# Altium schematic sheet 780-00029,rev1,Pg1,Backplane, Instrument Crate.SchDoc
size B; PageSetup: Record=PageOptions|CenterHorizontal=True|CenterVertical=True|PrintScale=1.09|XCorrection=1.00|YCorrection=1.00|PrintKind=0|BorderSize=5000000|LeftOffset=0|BottomOffset=0|Orientation=2|PaperLength=1000|PaperWidth=1000|Scale=100|PaperSource=7|PrintQuality=-4|MediaType=1|DitherType=10|PaperKind=Tabloid 11 x 17in|PrintScaleMode=1
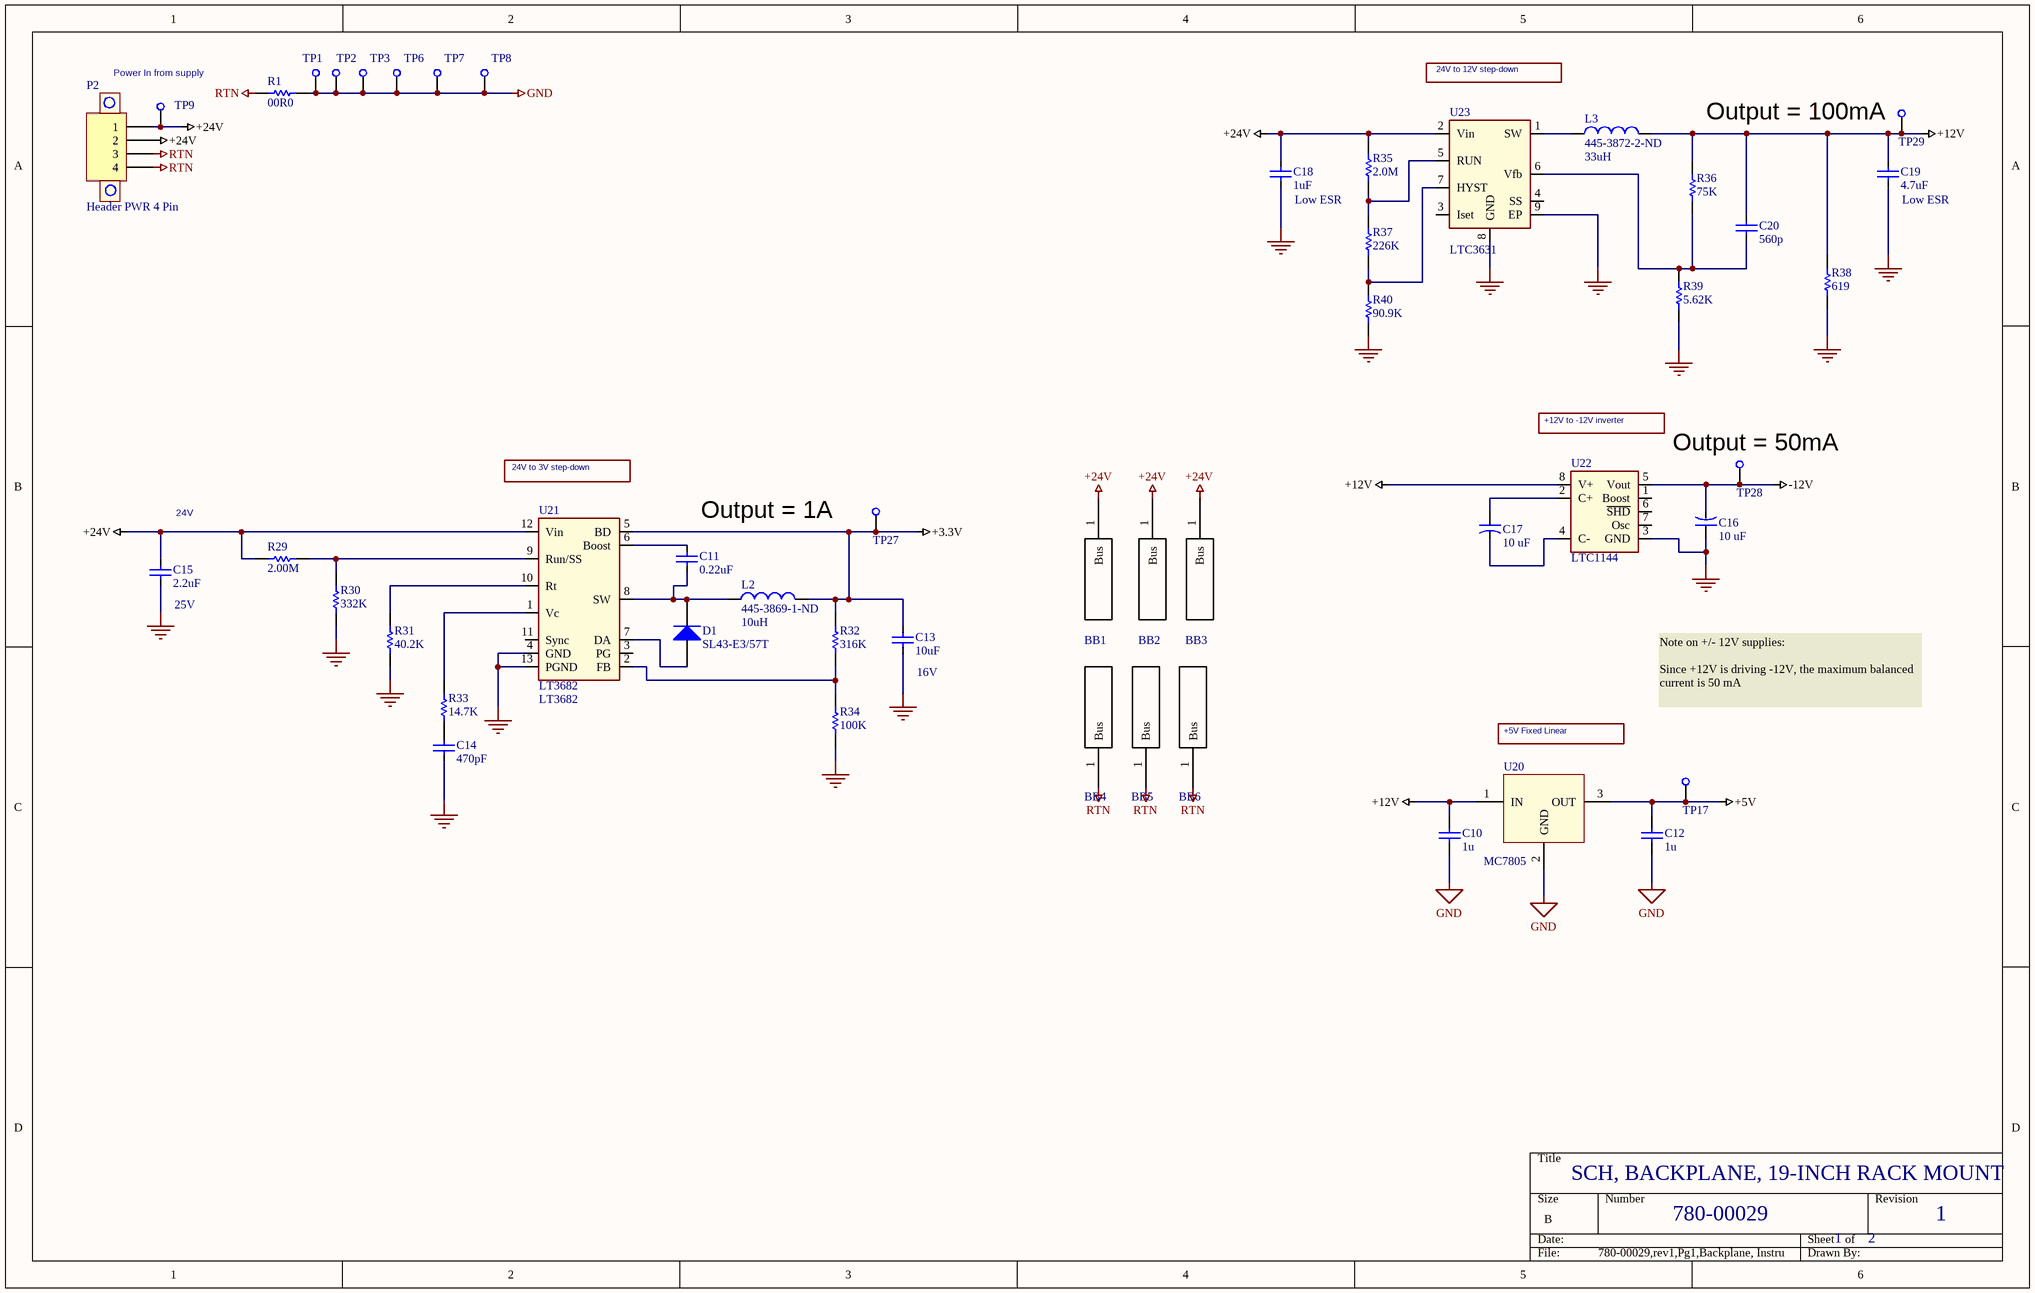
[diagram p0: 780-00029,rev1,Pg1,Backplane, Instrument Crate.SchDoc]

## Parts
BB1  Bus Bar  [Bus Bar 1.5" pitch]  (value not drawn)
BB2  Bus Bar  [Bus Bar 1.5" pitch]  (value not drawn)
BB3  Bus Bar  [Bus Bar 1.5" pitch]  (value not drawn)
BB4  Bus Bar  [Bus Bar 1.5" pitch]  (value not drawn)
BB5  Bus Bar  [Bus Bar 1.5" pitch]  (value not drawn)
BB6  Bus Bar  [Bus Bar 1.5" pitch]  (value not drawn)
C10  1u  [2012[0805]]
C11  value 0.22uF  [SMD_0805]  (hidden comment: Cap SMD)
C12  1u  [2012[0805]]
C13  16V  value 10uF  [SMD_0805]
C14  value 470pF  [SMD_0805]  (hidden comment: Cap SMD)
C15  25V  value 2.2uF  [SMD_0805]
C16  value 10 uF  [SMD_CAP_3216]  (hidden comment: 16V)
C17  value 10 uF  [SMD_CAP_3216]  (hidden comment: 16V)
C18  Low ESR  value 1uF  [SMD_1206]
C19  Low ESR  value 4.7uF  [SMD_1206]
C20  value 560p  [SMD_0805]  (hidden comment: Cap SMD)
D1  SL43-E3/57T  [DO-214AB]
L2  445-3869-1-ND  value 10uH  [Inductor TDC SLF]
L3  445-3872-2-ND  value 33uH  [Inductor TDC SLF]
P2  Header PWR 4 Pin  [HDR-4 pin w/screw]
R1  value 00R0  [SMD_0805]  (hidden comment: Res 0805)
R29  value 2.00M  [SMD_0805]  (hidden comment: Res 0805)
R30  value 332K  [SMD_0805]  (hidden comment: Res 0805)
R31  value 40.2K  [SMD_0805]  (hidden comment: Res 0805)
R32  value 316K  [SMD_0805]  (hidden comment: Res 0805)
R33  value 14.7K  [SMD_0805]  (hidden comment: Res 0805)
R34  value 100K  [SMD_0805]  (hidden comment: Res 0805)
R35  value 2.0M  [SMD_0805]  (hidden comment: Res 0805)
R36  value 75K  [SMD_0805]  (hidden comment: Res 0805)
R37  value 226K  [SMD_0805]  (hidden comment: Res 0805)
R38  value 619  [SMD_0805]  (hidden comment: Res 0805)
R39  value 5.62K  [SMD_0805]  (hidden comment: Res 0805)
R40  value 90.9K  [SMD_0805]  (hidden comment: Res 0805)
TP1  Test point  [PAD_80D_052H]  (value not drawn)
TP2  Test point  [PAD_80D_052H]  (value not drawn)
TP3  Test point  [PAD_80D_052H]  (value not drawn)
TP6  Test point  [PAD_80D_052H]  (value not drawn)
TP7  Test point  [PAD_80D_052H]  (value not drawn)
TP8  Test point  [PAD_80D_052H]  (value not drawn)
TP9  Test Point SMD  [SMD_TEST POINT]  (value not drawn)
TP17  Test Point SMD  [SMD_TEST POINT]  (value not drawn)
TP27  Test Point SMD  [SMD_TEST POINT]  (value not drawn)
TP28  Test Point SMD  [SMD_TEST POINT]  (value not drawn)
TP29  Test Point SMD  [SMD_TEST POINT]  (value not drawn)
U20  value MC7805  [TO-252(D-PAK)  PowerPAD]  (hidden comment: Voltage Reg, Fixed)
U21  LT3682  [DD12/DFN12]
U22  LTC1144  [S8_M]
U23  LTC3631  [DD8/DFN8]

## Nets
+3.3V: C13.2 L2.2 R32.2 TP27.1(TP) U21.5(BD)
+5V: C12.1 TP17.1(TP) U20.3(OUT)
+12V: C10.1 C19.2 C20.2 L3.2 R36.2 R38.2 TP29.1(TP) U20.1(IN) U22.8(V+)
+24V: BB1.1(Bus) BB2.1(Bus) BB3.1(Bus) C15.2 C18.2 P2.1 P2.2 R29.1 R35.2 TP9.1(TP) U21.12(Vin) U23.2(Vin)
-12V: C16.2 TP28.1(TP) U22.5(Vout)
GND: C10.2 C12.2 C13.1 C14.1 C15.1 C16.1 C18.1 C19.1 R1.2 R30.1 R31.1 R34.1 R38.1 R39.1 R40.1 TP1.1(TP) TP2.1(TP) TP3.1(TP) TP6.1(TP) TP7.1(TP) TP8.1(TP) U20.2(GND) U21.4(GND) U21.13(PGND) U22.3(GND) U23.8(GND) U23.9(EP)
RTN: BB4.1(Bus) BB5.1(Bus) BB6.1(Bus) P2.3 P2.4 R1.1
NetC11_1: C11.1 D1.2(K) L2.1 U21.8(SW)
NetC11_2: C11.2 U21.6(Boost)
NetC14_2: C14.2 R33.1
NetC17_1: C17.1 U22.2(C+)
NetC17_2: C17.2 U22.4(C-)
NetC20_1: C20.1 R36.1 R39.2 U23.6(Vfb)
NetD1_1: D1.1(A) U21.7(DA)
NetL3_1: L3.1 U23.1(SW)
NetR29_2: R29.2 R30.2 U21.9(Run/SS)
NetR31_2: R31.2 U21.10(Rt)
NetR32_1: R32.1 R34.2 U21.2(FB)
NetR33_2: R33.2 U21.1(Vc)
NetR35_1: R35.1 R37.2 U23.5(RUN)
NetR37_1: R37.1 R40.2 U23.7(HYST)

Not connected (* = marked no-connect by the designer): U21 3(PG) 11(Sync); U22 1(Boost) 6(~{SHD}) 7(Osc); U23 3(Iset) 4(SS)

## Notes on the sheet
- Power In from supply
- 24V to 12V step-down
- Output = 100mA
- +12V to -12V inverter
- 24V to 3V step-down
- (near TP28) Output = 50mA
- (near C15) 24V
- Output = 1A
- Note on +/- 12V supplies:
  Since +12V is driving -12V, the maximum balanced current is 50 mA
- +5V Fixed Linear
- SCH, BACKPLANE, 19-INCH RACK MOUNT
- 780-00029
- 1
- 2

## Library data of the parts
BB1-BB6 = Bus Bar: Manufacturer: Circuit Components Inc.; Manuf p/n: B250-4-1.5-FO; LCO p/n: 160-00005; Value: Bus Bar; Vendor: Circuit Components Inc.; Vendor p/n: B250-4-1.5-FO
C10 C12 = Cap: Capacitor; Manufacturer: Taiyo Yuden; Manuf p/n: UMK212F105ZG-T; Vendor: DIGIKEY; Vendor Mult.: 10; Vendor p/n: 587-1308-1-ND; LCO p/n: 120-00027; Value: 1u; COST: 0.088
C11 = Cap SMD: Capacitor; LCO p/n: 120-00042
C13 = Cap SMD: Capacitor; LCO p/n: 120-00007
C14 = Cap SMD: Capacitor; LCO p/n: 120-00037
C15 = Cap SMD: Capacitor; Manufacturer: Taiyo Yuden; Manuf p/n: TMK212BJ225KG-T; Vendor: Digi-Key; Vendor p/n: 587-1292-1-ND; Vendor Mult.: 10; LCO p/n: 120-00038; COST: 0.275
C16 C17 = Cap Tant 16V: outline 3.2mm x 1.6mm; Manufacturer: KEMET; Manuf p/n: T494A106M016AT; Vendor: DIGIKEY; Vendor p/n: 399-3824-1-ND; Vendor Mult.: 1; LCO p/n: 120-00001; COST: 0.78
C18 = Cap SMD: Capacitor; Manufacturer: TDK; Manuf p/n: C3225X7R1H105K/1.6; Vendor: Digi-Key; Vendor p/n: 445-3931-1-ND; Vendor Mult.: 10; LCO p/n: 120-00039
C19 = Cap SMD: Capacitor; Manufacturer: TDK; Manuf p/n: C3216X7R1E475K; Vendor: Digi-Key; Vendor p/n: 445-1606-1-ND; Vendor Mult.: 10; LCO p/n: 120-00040
C20 = Cap SMD: Capacitor; LCO p/n: 120-00036
D1 = Diode: Default Diode; Manufacturer: Vishay/Dale; Value: 4A 30V; Vendor: DigiKey; Vendor Mult.: 1; Vendor p/n: SL43-E3/57TGICT-ND; LCO p/n: 140-00002; COST: 0.98; Manuf p/n: SL43-E3/57T
L2 = Inductor SMD 10uH 1.8A: Inductor; Manufacturer: TDK; Manuf p/n: SLF7045T-100M1R8-H; Vendor: Digi-Key; Vendor Mult.: 1; LCO p/n: 155-00015; Vendor p/n: 445-3869-1-ND
L3 = Inductor SMD 10uH 1.8A: Inductor; Manufacturer: TDK; Manuf p/n: SLF7045T-330M1R1-H; Vendor: Digi-Key; Vendor Mult.: 1; LCO p/n: 155-00016; Vendor p/n: 445-3872-2-ND
P2 = Header 4 PWR: Header, 4-Pin; Manufacturer: tyco; Manuf p/n: 796867-4; Vendor: Digi-key; Vendor p/n: A98457-ND; Vendor Mult.: 1; LCO p/n: 125-00082; VALUE: Header 4-pin PWR
R1 = Res SMD: Resistor 0805; Manufacturer: Vishay/Dale; Manuf p/n: CRCW080500R0FKEA; Vendor: DIGIKEY; Vendor p/n: 541-00R0CCT-ND; Vendor Mult.: 10; LCO p/n: 180-00033; COST: 0.09
R29 = Res SMD: Resistor 0805; Manufacturer: Vishay/Dale; Manuf p/n: CRCW08052.00MFKEA; Vendor: DIGIKEY; Vendor p/n: 541-2.00MCCT-ND; Vendor Mult.: 10; LCO p/n: 181-02004; COST: 0.09
R30 = Res SMD: Resistor 0805; Manufacturer: Vishay/Dale; Manuf p/n: CRCW0805332KFKEA; Vendor: DIGIKEY; Vendor p/n: 541-332KCCT-ND; Vendor Mult.: 10; LCO p/n: 181-03323; COST: 0.09
R31 = Res SMD: Resistor 0805; Manufacturer: Vishay/Dale; Manuf p/n: CRCW080540.2KFKEA; Vendor: DIGIKEY; Vendor p/n: 541-40.2KCCT-ND; Vendor Mult.: 10; LCO p/n: 181-04021; COST: 0.09
R32 = Res SMD: Resistor 0805; Manufacturer: Vishay/Dale; Manuf p/n: CRCW0805316KFKEA; Vendor: DIGIKEY; Vendor p/n: 541-316KCCT-ND; Vendor Mult.: 10; LCO p/n: 181-03163; COST: 0.09
R33 = Res SMD: Resistor 0805; Manufacturer: Vishay/Dale; Manuf p/n: CRCW080514.7KFKEA; Vendor: DIGIKEY; Vendor p/n: 541-14.7KCCT-ND; Vendor Mult.: 10; LCO p/n: 181-01472; COST: 0.09
R34 = Res SMD: Resistor 0805; Manufacturer: Vishay/Dale; Manuf p/n: CRCW0805100KFKEA; Vendor: DIGIKEY; Vendor p/n: 541-100KCCT-ND; Vendor Mult.: 10; LCO p/n: 181-01003; COST: 0.09
R35 = Res SMD: Resistor 0805; Manufacturer: Vishay/Dale; Manuf p/n: CRCW08052.0MFKEA; Vendor: DIGIKEY; Vendor p/n: 541-2.0MCCT-ND; Vendor Mult.: 10; LCO p/n: 181-02004; COST: 0.09
R36 = Res SMD: Resistor 0805; Manufacturer: Vishay/Dale; Manuf p/n: CRCW080575KFKEA; Vendor: DIGIKEY; Vendor p/n: 541-75KCCT-ND; Vendor Mult.: 10; LCO p/n: 181-07502; COST: 0.09
R37 = Res SMD: Resistor 0805; Manufacturer: Vishay/Dale; Manuf p/n: CRCW0805226KFKEA; Vendor: DIGIKEY; Vendor p/n: 541-226KCCT-ND; Vendor Mult.: 10; LCO p/n: 181-02263; COST: 0.09
R38 = Res SMD: Resistor 0805; Manufacturer: Vishay/Dale; Manuf p/n: CRCW0805619FKEA; Vendor: DIGIKEY; Vendor p/n: 541-619CCT-ND; Vendor Mult.: 10; LCO p/n: 181-06190; COST: 0.09
R39 = Res SMD: Resistor 0805; Manufacturer: Vishay/Dale; Manuf p/n: CRCW08055.62KFKEA; Vendor: DIGIKEY; Vendor p/n: 541-5.62KCCT-ND; Vendor Mult.: 10; LCO p/n: 181-05621; COST: 0.09
R40 = Res SMD: Resistor 0805; Manufacturer: Vishay/Dale; Manuf p/n: CRCW080590.9KFKEA; Vendor: DIGIKEY; Vendor p/n: 541-90.9KCCT-ND; Vendor Mult.: 10; LCO p/n: 181-09092; COST: 0.09
TP1-TP3 TP6-TP8 = Test point: Manufacturer: Keystone; Manuf p/n: 1249; Vendor: Bisco Ind.; LCO p/n: 125-00013; Vendor p/n: 1249; COST: 0.18; VALUE: Test point
TP9 TP17 TP27-TP29 = Test Point SMD: SMD loop test point; LCO p/n: 160-00001; VALUE: Test Point SMD
U20 = Voltage Reg, Fixed: MC78M05; Manufacturer: Fairchild; Manuf p/n: MC78M05CDTX; LCO p/n: 150-00101; Vendor: Digi-Key; Vendor Mult.: 1; Vendor p/n: MC78M05CDTXCT-ND; COST: 0.61
U21 = LT3682: 1A uPwr Step-Down switching regulator; Manufacturer: Linear; Manuf p/n: LT3682EDD#PBF; LCO p/n: 150-00069; Vendor: Digi-Key; Vendor Mult.: 1; Vendor p/n: LT3682EDD#PBF-ND; COST: 6.28; VALUE: LT3682
U22 = LTC1144: IC VOLT CONV SW-CAP W/SHTDN8SOIC; Manufacturer: Linear; Manuf p/n: LTC1144CS8#PBF; LCO p/n: 150-00070; Vendor: Digi_Key; Vendor Mult.: 1; Vendor p/n: LTC1144CS8#PBF-ND; COST: 4.90; VALUE: LTC1144
U23 = LTC3631: IC CONV STP-DWN ADJ 8-DFN; Manufacturer: Linear; Manuf p/n: LTC3631EDD#PBF; LCO p/n: 150-00071; Vendor: Digi-Key; Vendor Mult.: 1; Vendor p/n: LTC3631EDD#PBF-ND; COST: 6.28; VALUE: LTC3631